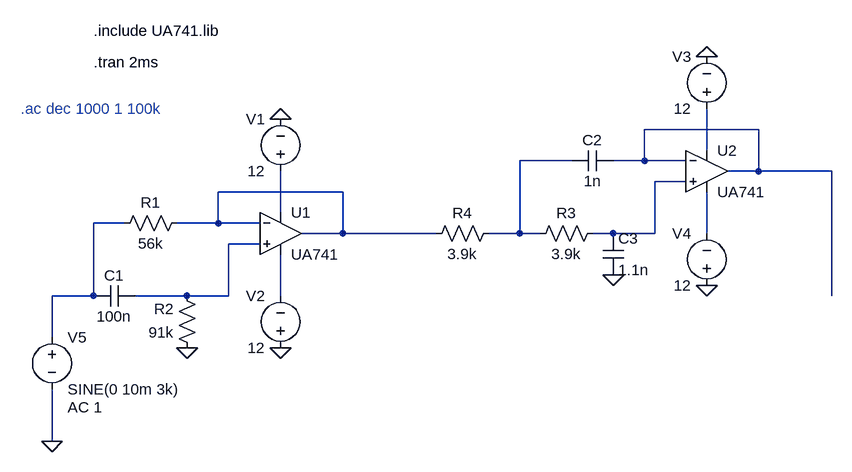
[diagram p0: schematic stage3_filter_sallen_key_lpf_hpf.asc]
stage3_filter_sallen_key_lpf_hpf.asc, the LTspice schematic file:
Version 4
SHEET 1 932 680
WIRE 816 112 640 112
WIRE 736 144 736 80
WIRE 528 160 448 160
WIRE 640 160 640 112
WIRE 640 160 592 160
WIRE 704 160 640 160
WIRE 816 176 816 112
WIRE 816 176 768 176
WIRE 928 176 816 176
WIRE 704 192 656 192
WIRE 176 208 -16 208
WIRE 80 240 80 176
WIRE -160 256 -208 256
WIRE -16 256 -16 208
WIRE -16 256 -80 256
WIRE 48 256 -16 256
WIRE 176 272 176 208
WIRE 176 272 112 272
WIRE 320 272 176 272
WIRE 448 272 448 160
WIRE 448 272 400 272
WIRE 480 272 448 272
WIRE 592 272 560 272
WIRE 656 272 656 192
WIRE 656 272 592 272
WIRE 736 272 736 208
WIRE 48 288 0 288
WIRE -208 368 -208 256
WIRE -208 368 -272 368
WIRE -192 368 -208 368
WIRE -64 368 -144 368
WIRE 0 368 0 288
WIRE 0 368 -64 368
WIRE 80 368 80 304
WIRE 928 368 928 176
WIRE -272 432 -272 368
WIRE -272 592 -272 512
FLAG 80 96 0
FLAG 80 448 0
FLAG 736 0 0
FLAG 736 352 0
FLAG -64 448 0
FLAG 592 336 0
FLAG -272 592 0
SYMBOL OpAmps\\opamp2 80 208 R0
SYMATTR InstName U1
SYMATTR Value UA741
SYMBOL voltage 80 192 R180
WINDOW 0 24 96 Left 2
WINDOW 3 24 16 Left 2
WINDOW 123 0 0 Left 0
WINDOW 39 0 0 Left 0
SYMATTR InstName V1
SYMATTR Value 12
SYMBOL voltage 80 464 R180
WINDOW 0 24 96 Left 2
WINDOW 3 24 16 Left 2
SYMATTR InstName V2
SYMATTR Value 12
SYMBOL OpAmps\\opamp2 736 112 R0
SYMATTR InstName U2
SYMATTR Value UA741
SYMBOL voltage 736 96 R180
WINDOW 0 24 96 Left 2
WINDOW 3 24 16 Left 2
SYMATTR InstName V3
SYMATTR Value 12
SYMBOL voltage 736 368 R180
WINDOW 0 24 96 Left 2
WINDOW 3 24 16 Left 2
WINDOW 123 0 0 Left 0
WINDOW 39 0 0 Left 0
SYMATTR InstName V4
SYMATTR Value 12
SYMBOL res -64 240 R90
WINDOW 0 0 56 VBottom 2
WINDOW 3 32 56 VTop 2
SYMATTR InstName R1
SYMATTR Value 56k
SYMBOL res -48 464 R180
WINDOW 0 36 76 Left 2
WINDOW 3 36 40 Left 2
SYMATTR InstName R2
SYMATTR Value 91k
SYMBOL cap -144 352 R90
WINDOW 0 0 32 VBottom 2
WINDOW 3 32 32 VTop 2
SYMATTR InstName C1
SYMATTR Value 100n
SYMBOL cap 592 144 R90
WINDOW 0 0 32 VBottom 2
WINDOW 3 32 32 VTop 2
SYMATTR InstName C2
SYMATTR Value 1n
SYMBOL cap 576 272 R0
SYMATTR InstName C3
SYMATTR Value 1.1n
SYMBOL res 576 256 R90
WINDOW 0 0 56 VBottom 2
WINDOW 3 32 56 VTop 2
SYMATTR InstName R3
SYMATTR Value 3.9k
SYMBOL res 416 256 R90
WINDOW 0 0 56 VBottom 2
WINDOW 3 32 56 VTop 2
SYMATTR InstName R4
SYMATTR Value 3.9k
SYMBOL voltage -272 416 R0
WINDOW 123 24 124 Left 2
WINDOW 39 0 0 Left 0
SYMATTR Value2 AC 1
SYMATTR InstName V5
SYMATTR Value SINE(0 10m 3k)
TEXT -208 -40 Left 2 !.include UA741.lib
TEXT -208 8 Left 2 !.tran 2ms
TEXT -320 80 Left 2 ;.ac dec 1000 1 100k

The netlist it stands for:
* stage3_filter_sallen_key_lpf_hpf.asc
XU1 N009 N005 N006 N010 N005 UA741  ; pins In+ In- V+ V- OUT
V1 N006 0 12
V2 0 N010 12
XU2 N004 N001 N002 N008 N001 UA741  ; pins In+ In- V+ V- OUT
V3 N002 0 12
V4 0 N008 12
R1 N005 N007 56k
R2 0 N009 91k
C1 N009 N007 100n
C2 N001 N003 1n
C3 N004 0 1.1n
R3 N004 N003 3.9k
R4 N003 N005 3.9k
V5 N007 0 SINE(0 10m 3k) AC 1
.include UA741.lib
.tran 2ms
* .ac dec 1000 1 100k
.backanno
.end